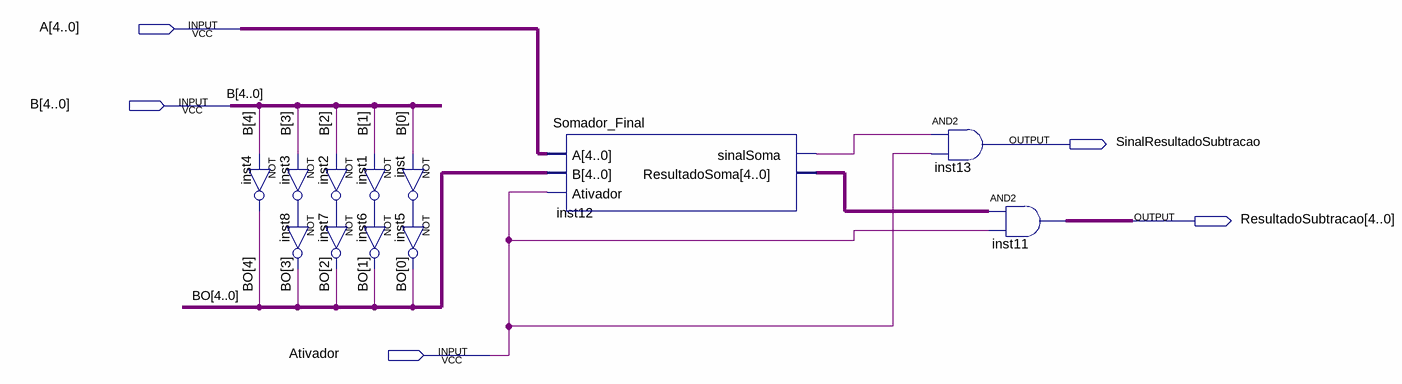
[diagram p0: schematic sheet]
// Quartus schematic Subtracao_Final.bdf as structural Verilog: 12 symbols, 5 pins
module Subtracao_Final (
  input  [4:0] A,
  input  [4:0] B,
  input  Ativador,
  output SinalResultadoSubtracao,
  output [4:0] ResultadoSubtracao
);

  wire inst1_out, inst2_out, inst3_out, inst12_sinalsoma, inst_out;
  wire [4:0] BO, inst12_resultadosoma;

  not inst3 (inst3_out, B[3]);
  not inst4 (BO[4], B[4]);
  not inst8 (BO[3], inst3_out);
  not inst1 (inst1_out, B[1]);
  not inst2 (inst2_out, B[2]);
  not inst6 (BO[1], inst1_out);
  not inst7 (BO[2], inst2_out);
  not inst (inst_out, B[0]);
  not inst5 (BO[0], inst_out);
  Somador_Final inst12 (
    .A(A), .B(BO), .Ativador(Ativador), .sinalSoma(inst12_sinalsoma), .ResultadoSoma(inst12_resultadosoma));
  and inst13 (SinalResultadoSubtracao, inst12_sinalsoma, Ativador);
  assign ResultadoSubtracao = inst12_resultadosoma & {5{Ativador}};  // AND2 inst11, 5 bits wide
endmodule
